# Altium schematic sheet BQ25504v2.SchDoc: BQ25504
size A4; DrawnBy: Manuel Palacios
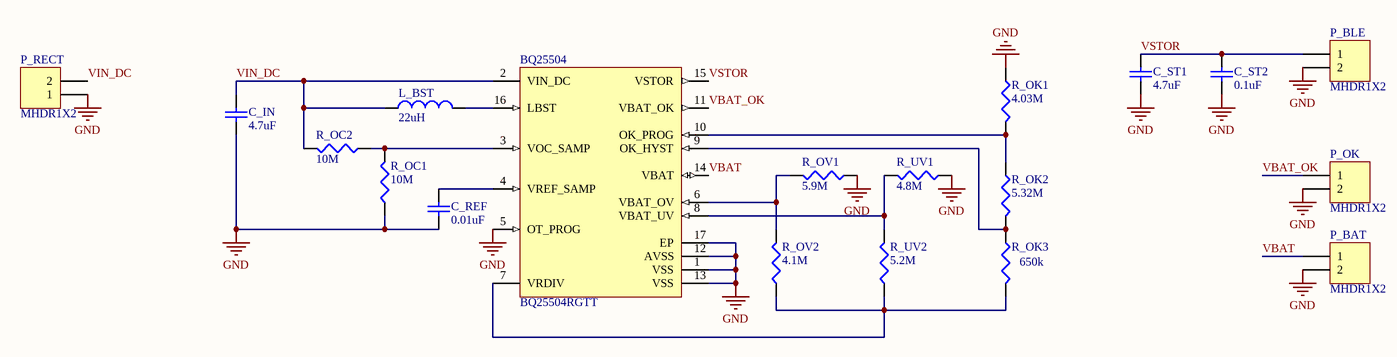
[diagram p0: BQ25504v2.SchDoc]

## Parts
BQ25504  BQ25504RGTT  [RGT0016C_V]
C_IN  value 4.7uF  [0402]  (hidden comment: Cap Semi)
C_REF  value 0.01uF  [0402]  (hidden comment: Cap Semi)
C_ST1  value 4.7uF  [0402]  (hidden comment: Cap Semi)
C_ST2  value 0.1uF  [0402]  (hidden comment: Cap Semi)
L_BST  value 22uH  [0402-A]  (hidden comment: Inductor)
P_BAT  MHDR1X2  [MHDR1X2]
P_BLE  MHDR1X2  [MHDR1X2]
P_OK  MHDR1X2  [MHDR1X2]
P_RECT  MHDR1X2  [MHDR1X2]
R_OC1  value 10M  [12Z-2010]  (hidden comment: Res3)
R_OC2  value 10M  [12Z-2010]  (hidden comment: Res3)
R_OK1  value 4.03M  [12Z-2010]  (hidden comment: Res3)
R_OK2  value 5.32M  [12Z-2010]  (hidden comment: Res3)
R_OK3  value 650k  [12Z-2010]  (hidden comment: Res3)
R_OV1  value 5.9M  [12Z-2010]  (hidden comment: Res3)
R_OV2  value 4.1M  [12Z-2010]  (hidden comment: Res3)
R_UV1  value 4.8M  [12Z-2010]  (hidden comment: Res3)
R_UV2  value 5.2M  [12Z-2010]  (hidden comment: Res3)

## Nets
GND: BQ25504.1(VSS) BQ25504.5(OT_PROG) BQ25504.12(AVSS) BQ25504.13(VSS) BQ25504.17(EP) C_IN.1 C_REF.1 C_ST1.1 C_ST2.1 P_BAT.2 P_BLE.2 P_OK.2 P_RECT.1 R_OC1.1 R_OK1.1 R_OV1.1 R_UV1.1
VBAT: BQ25504.14(VBAT) P_BAT.1
VBAT_OK: BQ25504.11(VBAT_OK) P_OK.1
VIN_DC: BQ25504.2(VIN_DC) C_IN.2 L_BST.1 P_RECT.2 R_OC2.2
VSTOR: BQ25504.15(VSTOR) C_ST1.2 C_ST2.2 P_BLE.1
NetBQ25504_3: BQ25504.3(VOC_SAMP) R_OC1.2 R_OC2.1
NetBQ25504_4: BQ25504.4(VREF_SAMP) C_REF.2
NetBQ25504_6: BQ25504.6(VBAT_OV) R_OV1.2 R_OV2.2
NetBQ25504_7: BQ25504.7(VRDIV) R_OK3.2 R_OV2.1 R_UV2.1
NetBQ25504_8: BQ25504.8(VBAT_UV) R_UV1.2 R_UV2.2
NetBQ25504_9: BQ25504.9(OK_HYST) R_OK2.2 R_OK3.1
NetBQ25504_10: BQ25504.10(OK_PROG) R_OK1.2 R_OK2.1
NetBQ25504_16: BQ25504.16(LBST) L_BST.2

## Library data of the parts
BQ25504 = CMP-0321-00258-2: Ultra Low Power Boost Converter with Battery Management for Energy Harvester App, 0.13 V, -40 to 85 degC, 16-pin QFN (RGT), Green (RoHS & no Sb/Br); Manufacturer: Texas Instruments; Li-Ion: N; SubFamily: Battery Charge Management; Vin(Min)(V): 0.13; ComponentLink1URL: http://www.ti.com/general/docs/lit/getliterature.tsp?genericPartNumber=BQ25504&fileType=pdf; ComponentLink1Description: Datasheet; PartNumber: BQ25504RGTT; DatasheetVersion: SLUSAH0; PackageVersion: revH, Oct-2011; Lead Acid: N; PackageDescription: 16-Pin Plastic Quad Flat No-Lead, 3 x 3 mm Body, 0.5 mm Pitch, 1.7 x 1.7 mm Exposed Pad; Mounting Technology: Surface Mount; Eco-Plan: Green (RoHS & no Sb/Br); NiMH: N; PackageReference: RGT0016C; Over Voltage Protection: N; Li-Polymer: N; NiCd: N; Code_JEDEC: MO-220
C_IN C_REF C_ST1 C_ST2 = Cap Semi: Capacitor (Semiconductor SIM Model); Published: 8-Jun-2000; LatestRevisionDate: 29-May-2009; LatestRevisionNote: IPC-7351 Footprint Added.; PackageReference: C1206; Publisher: Altium Limited; PackageDescription: Chip Capacitor
L_BST = Inductor: Code_IEC: 1005; Published: 8-Jun-2000; LatestRevisionDate: 29-May-2009; LatestRevisionNote: IPC-7351 Footprint Added.; PackageReference: 0402-A; Publisher: Altium Limited; PackageDescription: Chip Inductor; Code_JEITA: 0402
P_BAT P_BLE P_OK P_RECT = MHDR1X2: Header, 2-Pin; LatestRevisionDate: 17-Jul-2002; LatestRevisionNote: Re-released for DXP Platform.; Publisher: Altium Limited
R_OC1 R_OC2 R_OK1-R_OK3 R_OV1 R_OV2 R_UV1 R_UV2 = Res3: Resistor; Published: 8-Jun-2000; LatestRevisionDate: 29-May-2009; LatestRevisionNote: IPC-7351 Footprint Added.; PackageReference: J1-0603; Publisher: Altium Limited; PackageDescription: Chip Resistor